# EAGLE design amp-PA-TQP7M9105-with-detect (EAGLE 9.5.1)
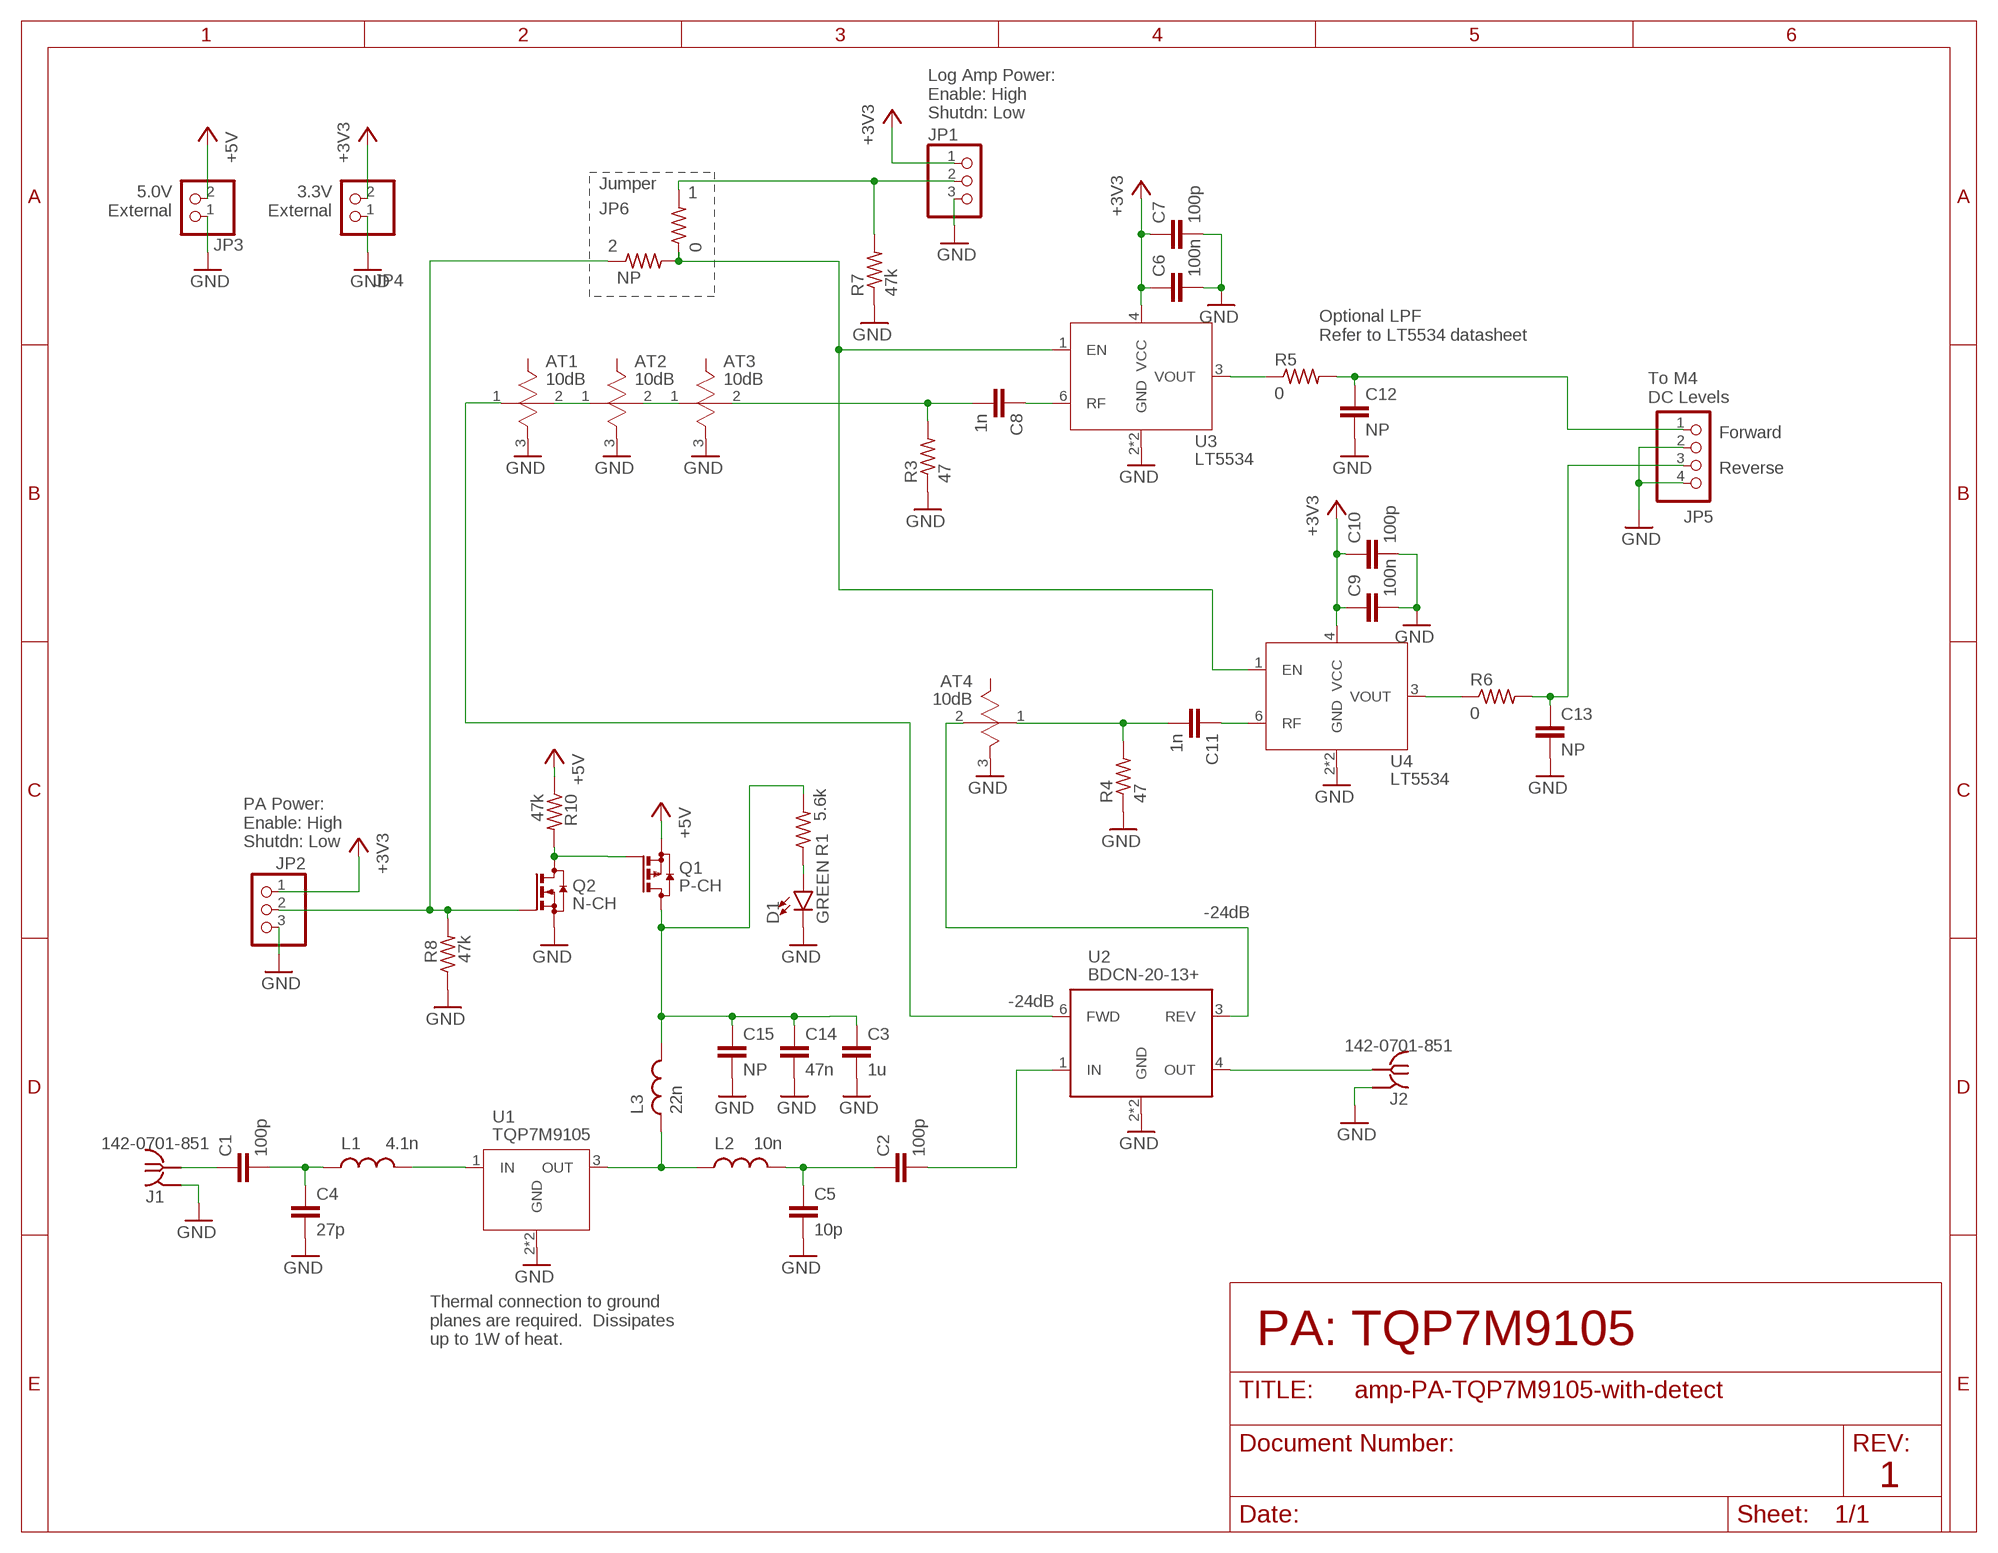
[diagram p0: schematic, sheet 1]

## Parts
AT1  10dB  PAT1220  [0805]
AT2  10dB  PAT0816  [0603]
AT3  10dB  PAT0816  [0603]
AT4  10dB  PAT0816  [0603]
C1  100p  C-EU0402-C-NOSILK  [.0402-C-NOSILK]
C2  100p  C-EU0603-C-NOSILK  [.0603-C-NOSILK]
C3  1u  C-EU0603-B-NOSILK  [.0603-B-NOSILK]
C4  27p  C-EU0402-C-NOSILK  [.0402-C-NOSILK]
C5  10p  C-EU0603-C-NOSILK  [.0603-C-NOSILK]
C6  100n  C-EU0603-B-NOSILK  [.0603-B-NOSILK]
C7  100p  C-EU0603-B-NOSILK  [.0603-B-NOSILK]
C8  1n  C-EU0402-C-NOSILK  [.0402-C-NOSILK]
C9  100n  C-EU0603-B-NOSILK  [.0603-B-NOSILK]
C10  100p  C-EU0603-B-NOSILK  [.0603-B-NOSILK]
C11  1n  C-EU0402-C-NOSILK  [.0402-C-NOSILK]
C12  NP  C-EU0603-B-NOSILK  [.0603-B-NOSILK]
C13  NP  C-EU0603-B-NOSILK  [.0603-B-NOSILK]
C14  47n  C-EU0603-B-NOSILK  [.0603-B-NOSILK]
C15  NP  C-EU0603-B-NOSILK  [.0603-B-NOSILK]
D1  GREEN  LED-GREEN0603  [LED-0603]
J1  142-0701-851  [142-0701-851]
J2  142-0701-851  [142-0701-851]
JP1  PINHD-1X3  [1X03]
JP2  PINHD-1X3  [1X03]
JP3  PINHD-1X2  [1X02]
JP4  PINHD-1X2  [1X02]
JP5  PINHD-1X4  [1X04]
JP6  NP  R-US_0603-B-NOSILK  [.0603-B-NOSILK]
L1  4.1n  L-US0402-C-NOSILK  [.0402-C-NOSILK]
L2  10n  L-US0603-C-NOSILK  [.0603-C-NOSILK@1]
L3  22n  L-US0805-C-NOSILK  [.0805-C-NOSILK]
Q1  P-CH  BSS84  [SOT23]
Q2  N-CH  BSS123  [SOT23]
R1  5.6k  R-US_0603-B-NOSILK  [.0603-B-NOSILK]
R3  47  R-US_0402-C-NOSILK  [.0402-C-NOSILK]
R4  47  R-US_0402-C-NOSILK  [.0402-C-NOSILK]
R5  0  R-US_0603-B-NOSILK  [.0603-B-NOSILK]
R6  0  R-US_0603-B-NOSILK  [.0603-B-NOSILK]
R7  47k  R-US_0402-B-NOSILK  [.0402-B-NOSILK]
R8  47k  R-US_0402-B-NOSILK  [.0402-B-NOSILK]
R9  0  R-US_0603-B-NOSILK  [.0603-B-NOSILK]
R10  47k  R-US_0402-B-NOSILK  [.0402-B-NOSILK]
U1  TQP7M9105  [TQP7M9105]
U2  BDCN-20-13+  [BDCN-20-13+]
U3  LT5534  [SC70]
U4  LT5534  [SC70]

## Nets
+3V3: C6.1 C7.1 C9.1 C10.1 JP1.1 JP2.1 JP4.2 U3.4(VCC) U4.4(VCC)
+5V: JP3.2 Q1.2(S) R10.1
CAPS: C3.1 C14.1 C15.1 L3.2 Q1.3(D) R1.2
FWD: C12.1 JP5.1 R5.2
GND: AT1.3(GND) AT2.3(GND) AT3.3(GND) AT4.3(GND) C3.2 C4.2 C5.2 C6.2 C7.2 C9.2 C10.2 C12.2 C13.2 C14.2 C15.2 D1.C J1.GND1(GND) J1.GND2(GND) J1.GND3(GND) J1.GND4(GND) J2.GND1(GND) J2.GND2(GND) J2.GND3(GND) J2.GND4(GND) JP1.3 JP2.3 JP3.1 JP4.1 JP5.2 JP5.4 Q2.2(S) R3.1 R4.1 R7.1 R8.1 U1.2(GND) U1.PAD(GND) U2.2(GND) U2.5(GND) U3.2(GND) U3.5(GND) U4.2(GND) U4.5(GND)
N$1 [RF2]: C1.1 J1.RF1(RF)
N$2 [RF2]: C2.2 U2.1(IN)
N$3 [RF2]: C1.2 C4.1 L1.1
N$4 [RF2]: L1.2 U1.1(IN)
N$5 [RF2]: L2.1 L3.1 U1.3(OUT)
N$6 [RF2]: C2.1 C5.1 L2.2
N$7 [RF2]: J2.RF1(RF) U2.4(OUT)
N$8 [RF1]: C8.1 U3.6(RF)
N$9 [RF1]: AT3.2 C8.2 R3.2
N$11: JP1.2 R7.2 R9.2
N$12 [RF1]: C11.1 U4.6(RF)
N$13 [RF1]: AT4.1 C11.2 R4.2
N$14: JP6.2 R9.1 U3.1(EN) U4.1(EN)
N$16 [RF1]: AT1.1 U2.6(FWD)
N$17 [RF1]: AT1.2 AT2.1
N$18 [RF1]: AT2.2 AT3.1
N$20: R5.1 U3.3(VOUT)
N$21: R6.1 U4.3(VOUT)
N$22 [RF1]: AT4.2 U2.3(REV)
N$23: Q1.1(G) Q2.3(D) R10.2
N$25: JP2.2 JP6.1 Q2.1(G) R8.2
N$26: D1.A R1.1
REV: C13.1 JP5.3 R6.2

## Notes on the sheet
- Log Amp Power:
  Enable: High
  Shutdn: Low
- Jumper
- 1
- 5.0V
  External
- 3.3V
  External
- 2
- Optional LPF
  Refer to LT5534 datasheet
- To M4
  DC Levels
- Forward
- Reverse
- PA Power:
  Enable: High
  Shutdn: Low
- -24dB
- -24dB
- Thermal connection to ground
  planes are required.  Dissipates
  up to 1W of heat.
- PA: TQP7M9105
- 1

## Library data of the parts
AT1 = AT-Susumu-PAT-attenuator:PAT1220: Chip Attenuator 0805 size (2012 metric) 100 mW Source: Datasheet <https://www.susumu.co.jp/common/pdf/n_catalog_partition16_en.pdf>
AT2-AT4 = AT-Susumu-PAT-attenuator:PAT0816: Chip Attenuator 0603 size (1608 metric) 64 mW Source: Datasheet <https://www.susumu.co.jp/common/pdf/n_catalog_partition16_en.pdf>
C1-C15 = oresat-rcl:C-EU: CAPACITOR, European symbol
D1 = SparkFun-LED:LED-GREEN: Green SMD LED Used in manufacturing of various products at SparkFun Packages: 0603 - SMD 0603 package [Product Link] <http://www.futureelectronics.com/en/technologies/semiconductors/optoelectronics/leds/Pages/9894312-LTST-C190GKT.aspx?CrossPart=HSMG-C190&IM=0> LilyPad 1206 - SMD1206 LilyPad package [Product Link] <http://www.futureelectronics.com/en/Technologies/Product.aspx?ProductID=IN150NGHARVATEKCORPORATION2049943&IM=0> 1206 - SMD1206 package [Product Link] <http://www.futureelectronics.com/en/technologies/semiconductors/optoelectronics/leds/Pages/8315665-LTST-C150KGKT.aspx?IM=0> 1206 Bottom Mount -SMD 1206 Bottom Mount [Product Link] <http://www.digikey.com/product-detail/en/lite-on-inc/LTST-C230KGKT/160-1456-1-ND/386854> SparkFun Products: Pro Mini 328 -5V <https://www.sparkfun.com/products/821> RedBoard <https://www.sparkfun.com/products/12757> MP3 Trigger <https://www.sparkfun.com/products/13720> Makey Makey <https://www.sparkfun.com/products/11076>
J1 J2 = J-Cinch-142-0701-851-SMA-end-launch:142-0701-851: SMA Jack 50Ω - End Launch Source: Datasheet <https://belfuse.com/resources/productinformations/cinchconnectivitysolutions/johnson/pi-ccs-john-142-0701-851.pdf>
JP1 JP2 = pinhead:PINHD-1X3: PIN HEADER
JP3 JP4 = pinhead:PINHD-1X2: PIN HEADER
JP5 = pinhead:PINHD-1X4: PIN HEADER
JP6 R1 R3-R10 = oresat-rcl:R-US_: RESISTOR, American symbol
L1-L3 = oresat-rcl:L-US: INDUCTOR, American symbol
Q1 = transistor-small-signal:BSS84: P-CHANNEL MOS FET
Q2 = transistor-small-signal:BSS123: N-CHANNEL MOS FET
U1 = U-Qorvo-TQP7M9105-PA:TQP7M9105: 1W High Linearity RF Amplifier, 50 - 1500 MHz
U2 = U-MiniCirc-BDCN-20-13+-coupler:BDCN-20-13+: Bi-Directional Coupler Band: 360 to 1000 MHz Coupling: 24 to 17.5 dB Source: Datasheet <https://www.minicircuits.com/pdfs/BDCN-20-13+.pdf>
U3 U4 = U-Linear-LT5534-RF-power-detector:LT5534: RF Power Detector Frequency Range: 50 MHz to 3 GHz Linear Dynamic Range: 60 dB Source: Datasheet <https://www.analog.com/media/en/technical-documentation/data-sheets/5534fc.pdf>

## Net classes
1 RF1: clearance 0.5 mm
2 RF2: clearance 0.8 mm

## Board
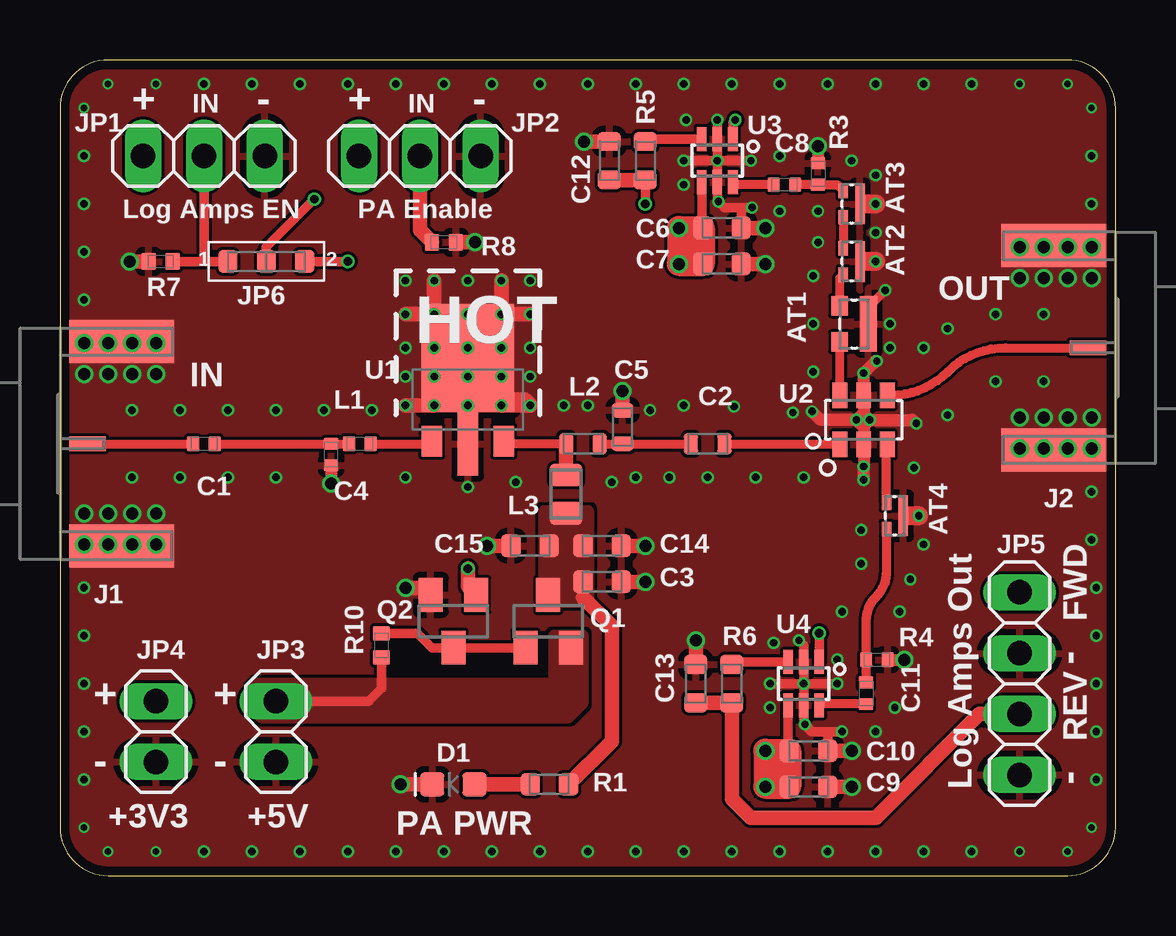
[diagram p1: board, top side]
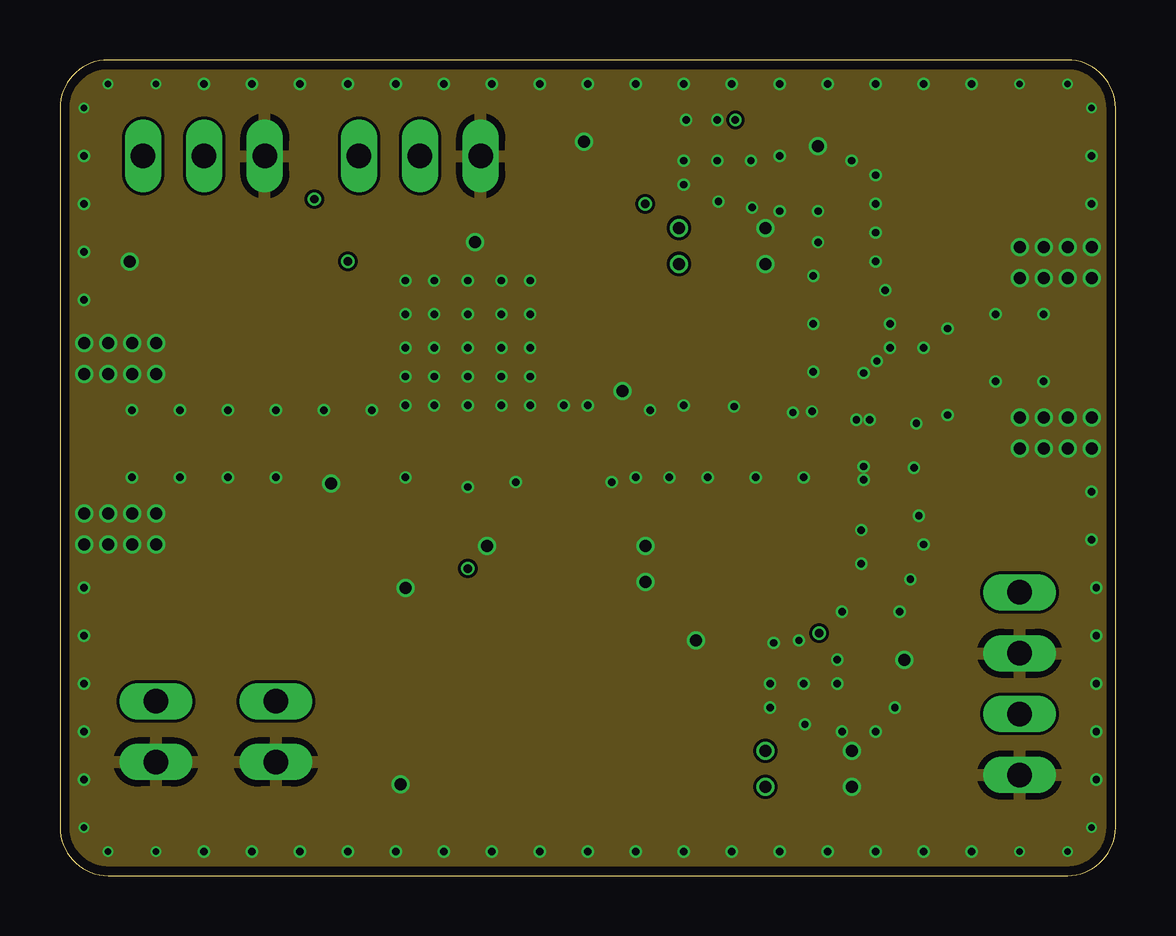
[diagram p2: board, inner layer Route2]
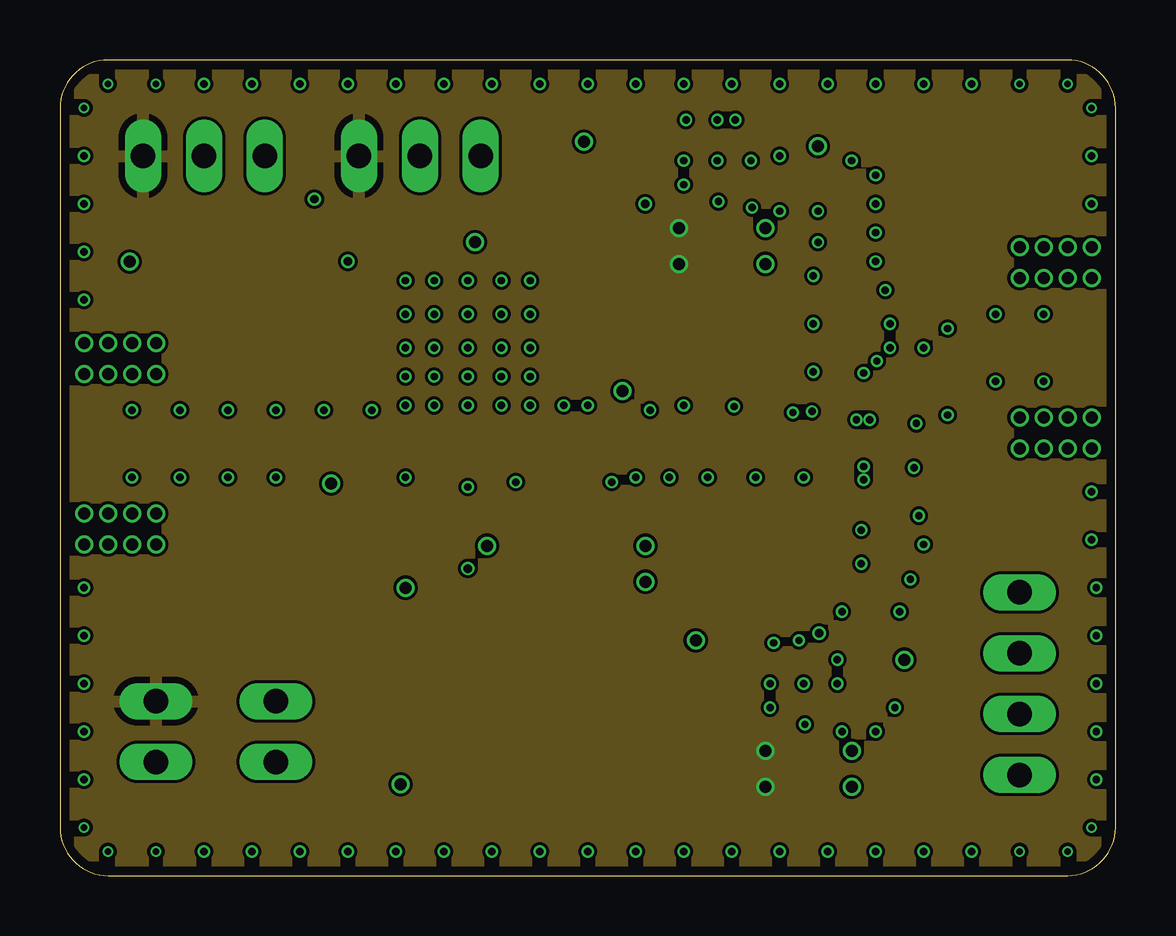
[diagram p3: board, inner layer Route15]
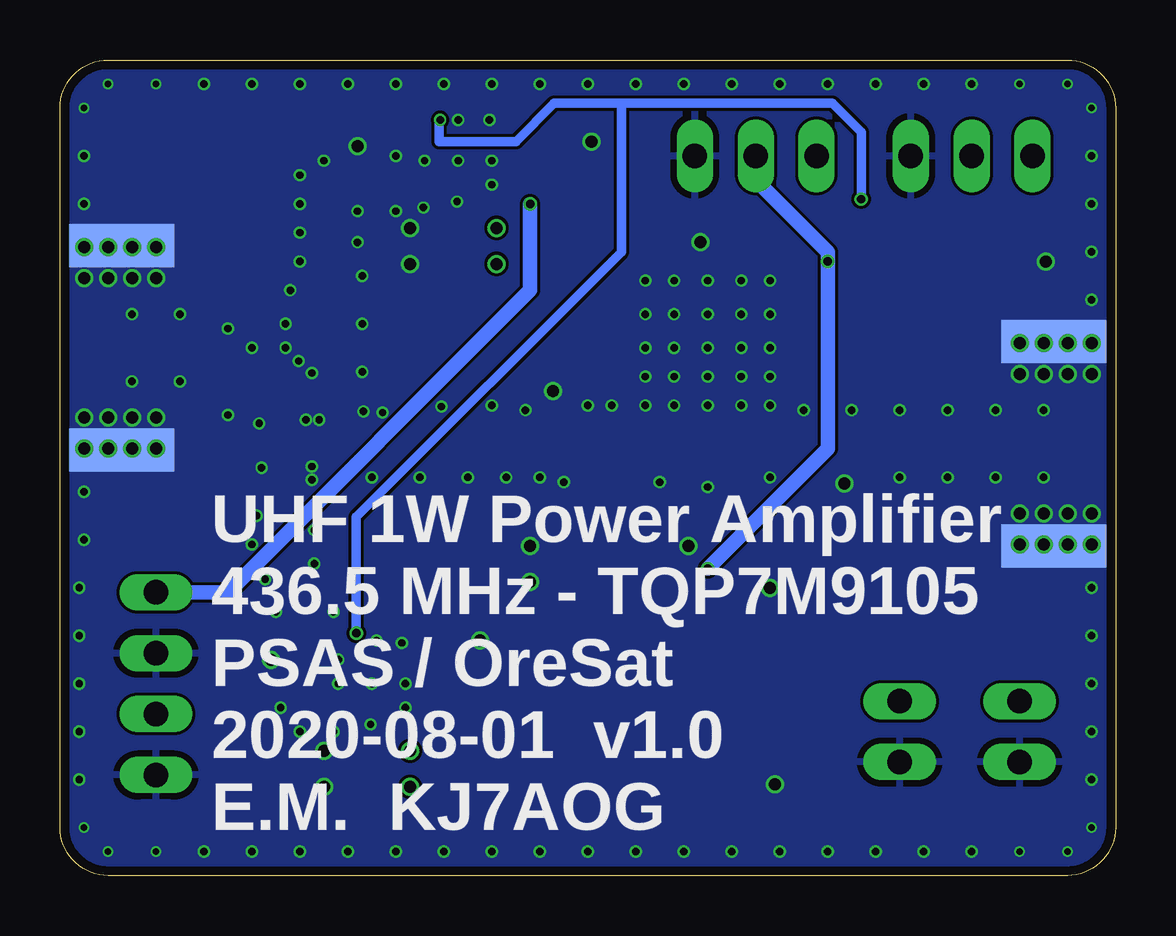
[diagram p4: board, bottom side, seen from below]

Size 44 x 34 mm. Coordinates in mm from the lower left corner, seen from the top.
Outline: 0,32 0,2 arc90 2,0 42,0 arc90 44,2 44,32 arc90 42,34 2,34 arc90 0,32
Copper layers (1*2*15*16): Top 0.035559375mm / dielectric 0.17018125mm / Route2 0.01778125mm / dielectric 47mil / Route15 0.01778125mm / dielectric 0.17018125mm / Bottom 0.035559375mm
Design rules "oshpark-4layer-tented": minimum track width 5mil, minimum drill 10mil, track to track 5mil, track to pad 5mil, pad to pad 5mil, via to via 5mil, smd to smd 5mil, copper to edge 15mil, drill to drill 6mil, minimum pad ring 4mil, minimum via ring 4mil, stop-mask expansion 2.5mil, vias tented up to drill 20mil, thermal gap 10mil

### Footprints (pad centres in the part's own frame; a part is rotated, then mirrored left to right if it is on the bottom)
0805 = smd 0.8 x 0.7: 1 -0.75,0.6; 2 0.75,0.6 | smd 2.3 x 0.7: 3 0,-0.6
0603 = smd 0.6 x 0.4: 1 -0.55,0.35; 2 0.55,0.35 | smd 1.7 x 0.4: 3 0,-0.35
.0402-C-NOSILK = smd 0.5 x 0.6: 1 -0.45,0; 2 0.45,0
.0603-C-NOSILK = smd 0.6 x 0.9: 1 -0.7,0; 2 0.7,0
.0603-B-NOSILK = smd 0.8 x 0.95: 1 -0.8,0; 2 0.8,0
LED-0603 = smd 1 x 1: A -0.877,0; C 0.877,0
142-0701-851 = smd 1.8 x 4.37: GND1 -4.255,-2.566; GND2 4.255,-2.566 | smd 1.8 x 4.37 bottom: GND3 -4.255,-2.566; GND4 4.255,-2.566 | smd 0.6 x 1.53: RF1 0,-1.146
1X03 = drill 1.016 long: 1 -2.54,0; 2 0,0; 3 2.54,0
1X02 = drill 1.016 long: 1 -1.27,0; 2 1.27,0
1X04 = drill 1.016 long: 1 -3.81,0; 2 -1.27,0; 3 1.27,0; 4 3.81,0
.0603-C-NOSILK@1 = smd 0.6 x 0.9: 1 -0.7,0; 2 0.7,0
.0805-C-NOSILK = smd 0.95 x 1.35: 1 -0.8,0; 2 0.8,0
SOT23 = smd 1 x 1.4: 1 -0.95,-1.1; 2 0.95,-1.1; 3 0,1.1
.0402-B-NOSILK = smd 0.6 x 0.7: 1 -0.5,0; 2 0.5,0
TQP7M9105 = smd 0.86 x 1.27: 1 -1.5,0.11; 3 1.5,0.11 | smd 0.86 x 2.65: 2 0,0 | smd 3.86 x 4.5: PAD 0,3.575
BDCN-20-13+ = smd 0.61 x 1.07: 1 -0.99,-1.025; 2 0,-1.025; 3 0.99,-1.025; 4 0.99,1.025; 5 0,1.025; 6 -0.99,1.025
SC70 = smd 0.4 x 1: 1 -0.65,-0.9; 2 0,-0.9; 3 0.65,-0.9; 4 0.65,0.9; 5 0,0.9; 6 -0.65,0.9

### Placement (x,y rotation side)
AT1  33.1,23 90 top
AT2  33,25.6 90 top
AT3  33,28 90 top
AT4  34.8,15 90 top
C1  6,18 0 top
C2  27,18 0 top
C3  22.6,12.25 0 top
C4  11.3,17.55 270 top
C5  23.45,18.7 90 top
C6  27.6,27 0 top
C7  27.6,25.5 0 top
C8  30.2,28.8 0 top
C9  31.2,3.7 0 top
C10  31.2,5.2 0 top
C11  33.6,7.6 90 top
C12  22.9,29.8 90 top
C13  26.5,8 90 top
C14  22.6,13.75 0 top
C15  19.6,13.75 180 top
D1  16.4,3.8 180 top
J1  0,18 90 top
J2  44,22 270 top
JP1  6,30 0 top
JP2  15,30 0 top
JP3  9,6 90 top
JP4  4,6 90 top
JP5  40,8 270 top
JP6  9.4,25.6 180 top
L1  12.5,18 0 top
L2  21.8,18 0 top
L3  21.1,15.9 270 top
Q1  20.35,10.6 0 top
Q2  16.4,10.6 180 top
R1  20.4,3.8 0 top
R3  31.6,29.25 270 top
R4  34.05,9 180 top
R5  24.4,29.8 270 top
R6  28,8 270 top
R7  4.2,25.6 0 top
R8  16,26.4 180 top
R9  7.8,25.6 180 top
R10  13.4,9.6 90 top
U1  17,18 0 top
U2  33.5,19 0 top
U3  27.4,29.8 180 top
U4  31,8 180 top

### Tracks (layer width: path | path; a pad name or v marks a point on that pad's centre or on a via)
+3V3  (via drill 0.5)
  Top 0.4: U3.4 26.75,27.05 C6.1 | U4.4 30.35,5.25 C10.1
  Top 1: C6.1 C7.1 v25.8,25.5 v25.8,27 26.7,27 26.75,27.05 | C10.1 C9.1 v29.4,3.7 v29.4,5.2 C10.1
  pour Route15: 0,34 44,34 44,0 0,0
+5V
  Top 0.4: R10.1 13.4,7.8 12.87,7.27 JP3.2
  pour Top (no thermals): 8,7 8.4,6.6 21.2,6.6 21.8,7.2 21.8,10 20.6,10 20.6,8 8.2,8 8,7.8
CAPS
  Top 0.4: C3.1 21.8,11.6
  Top 0.6: R1.2 23,5.6 23,10.4 21.8,11.6
  pour Top (no thermals): 20.2,15.2 22,15.2 22,11.4 20.2,11.4
FWD  (via drill 0.35)
  Top 0.4: R5.2 v24.4,28
  Top 0.6: C12.1 R5.2
  Bottom 0.4: JP5.1
  Bottom 0.6: v24.4,28 24.4,24.4 37,11.8 JP5.1
GND  (via drill 0.25, 0.3, 0.5)
  Top 0.4: v28.8,29.8 v27.4,29.8 | v27.4,29.8 v26,29.8 | v31,8 v29.6,8 | v31,8 v32.4,8 | v30.8,9.8 31,9.6 U4.2 v31,8 | v27.4,29.8 U3.5 27.4,28.15 v27.45,28.1 27.7,27.85 28.4,27.85 v28.85,27.85 | v31,8 U4.5 31,6.35 v31.05,6.3 31.35,6 32,6 v32.6,6 | v27.4,31.5 U3.2 v27.4,29.8 | v34.4,24.4 33.7,23.7 AT1.3 | C10.2 32,5.9 | C6.2 28.4,27.7
  Top 0.5: C4.2 v11.3,16.35 | v31.6,30.4 R3.1 | R4.1 v35.2,9 | v33.2,19 v33.75,19 | v33.75,19 35.55,19 v35.7,18.85 | v33.2,19 31.7,19 v31.35,19.35 | v33.75,19 33.5,18.75 U2.2 | v33.2,19 33.5,18.7 U2.2 | U2.5 33.5,19.3 v33.2,19 | U2.5 33.5,19.25 v33.75,19 | U2.2 v33.5,17.05 v33.5,16.5 | U2.5 v33.5,20.95 34,21.45 v34.05,21.45
  Top 0.6: v14.2,3.8 D1.C | v33,3.7 C9.2 | v33,5.2 C10.2 | v26.5,9.8 C13.2 | C3.2 v24.4,12.25 | C14.2 v24.4,13.75 | C15.2 v17.8,13.75 | C5.2 v23.45,20.2 | R7.1 v2.9,25.6 | R8.1 v17.3,26.4 | C12.2 v21.85,30.6 | v29.4,27 C6.2 | C7.2 v29.4,25.5 | v14.4,12 15.15,12 Q2.2 | v14.4,19.6 v15.6,19.6 | U1.PAD 18.73,19.84 19.39,19.84 19.61,19.61 | v19.6,19.6 v18.4,19.6 | v14.4,23.4 v15.6,23.4 v15.6,24.8 | v19.6,23.4 v18.4,23.4 v18.4,24.8
  Top 0.8: v34,28 33.55,28 | v34,25.6 33.55,25.6 | v35.8,15 35.35,15
  other vias: 1,15.1 2,15.1 4,15.1 1,13.8 2,13.8 4,13.8 1,20.9 2,20.9 4,20.9 1,22.2 2,22.2 4,22.2 43,26.2 42,26.2 40,26.2 40,24.9 42,24.9 43,24.9 43,17.8 42,17.8 40,17.8 40,19.1 42,19.1 43,19.1 3,16.6 5,16.6 3,19.4 5,19.4 41,20.6 39,20.6 41,23.4 39,23.4 1,2 2,1 4,1 42,1 43,2 40,1 1,32 2,33 4,33 43,32 42,33 40,33 3,20.9 3,22.2 3,15.1 3,13.8 41,19.1 41,17.8 41,24.9 41,26.2 34.6,23 17,19.6 15.6,20.8 17,20.8 18.4,20.8 15.6,22 17,22 18.4,22 17,23.4 19.6,20.8 19.6,22 14.4,20.8 14.4,22 14.4,24.8 17,24.8 19.6,24.8 34.6,22 1,4 1,6 1,8 1,10 1,12 1,30 1,28 1,26 1,24 6,33 8,33 10,33 12,33 14,33 16,33 18,33 20,33 22,33 24,33 26,33 28,33 30,33 32,33 34,33 36,33 38,33 43,30 43,28 43.2,4 43.2,6 43.2,8 43.2,10 43.2,12 43,14 43,16 6,1 8,1 10,1 12,1 14,1 16,1 18,1 20,1 22,1 24,1 26,1 28,1 38,1 36,1 34,1 32,1 30,1 7,16.6 9,16.6 7,19.4 9,19.4 11,19.4 13,19.4 17,16.2 14.4,16.6 19,16.4 37,22.8 36,22 37,19.2 31,16.6 29,16.6 27,16.6 25.4,16.6 23,16.4 24,16.6 21,19.6 22,19.6 24.6,19.4 26,19.6 28.1,19.55 30.55,19.3 34,26.8 33,29.8 34,29.2 30,30 31.6,27.7 30,27.7 31.6,26.4 31.4,21 31.4,23 31.4,25 26,28.8 26.1,31.5 35.6,17 36,13.8 35.45,12.35 35,11 32.4,9 32.6,11 33.4,13 33.4,14.4 34,6 34.8,7 29.6,7 29.75,9.7
  pour Top (rank 2): 0,0 44,0 44,34 0,34
  pour Bottom: 0,0 44,0 44,34 0,34
  pour Top (no thermals): 0,23.5 5.3,23.5 5.3,12.5 0,12.5
  pour Top (no thermals): 38.7,27.5 44,27.5 44,16.5 38.7,16.5
  pour Bottom (no thermals): 38.7,27.5 44,27.5 44,16.5 38.7,16.5
  pour Bottom (no thermals): 0,23.5 5.3,23.5 5.3,12.5 0,12.5
  pour Route2: 0,0 44,0 44,34 0,34
  pour Top (no thermals): 14,25.2 20,25.2 20,19.6 14,19.6
N$1
  Top 0.38: J1.RF1 C1.1
N$2
  Top 0.38: C2.2 32.48,18 U2.1
N$3
  Top 0.38: C1.2 C4.1 L1.1
N$4
  Top 0.38: L1.2 15.39,18 U1.1
N$5
  Top 0.38: L2.1 18.61,18 U1.3
  Top 0.6: L3.1 L2.1
N$6
  Top 0.38: L2.2 C5.1 C2.1
N$7
  Top 0.38: U2.4 34.65,20.02 arc45 37,21 arc-45 39.41,22 J2.RF1
N$8
  Top 0.38: C8.1 28.15,28.8 U3.6
N$9
  Top 0.38: AT3.2 32.4,28.8 R3.2 C8.2
N$11
  Top 0.4: R7.2 6,25.6 | 6,25.6 R9.2 | JP1.2 6,25.6
N$12
  Top 0.38: C11.1 31.7,7.15 U4.6
N$13
  Top 0.38: AT4.1 34.45,12.69 arc-45 34,11.6 arc45 33.6,10.63 R4.2 C11.2
N$14  (via drill 0.3, 0.35)
  Top 0.4: U4.1 v31.65,10.1 | U3.1 28.05,31.4 v28.15,31.5 | v10.6,28.2 8.6,26.2 R9.1
  Bottom 0.4: v31.65,10.1 31.65,14.95 20.6,26 20.6,32.2 | v28.15,31.5 28.2,31.45 28.2,30.6 25,30.6 23.4,32.2 20.6,32.2 | v10.6,28.2 10.6,31 11.8,32.2 20.6,32.2
N$16
  Top 0.38: U2.6 AT1.1
N$17
  Top 0.38: AT1.2 32.5,24.9 AT2.1
N$18
  Top 0.38: AT3.1 AT2.2
N$20
  Top 0.4: U3.3 24.5,30.7 R5.1
N$21
  Top 0.4: R6.1 28.1,8.9 U4.3
N$22
  Top 0.38: AT4.2 34.45,17.93 U2.3
N$23
  Top 0.4: R10.2 14.9,10.1 15.5,9.5 Q2.3 Q1.1
N$25  (via drill 0.35)
  Top 0.4: Q2.1 17,12.05 | JP6.1 v12,25.6
  Top 0.6: JP2.2 15,26.9 R8.2 | 17,12.05 v17,12.8
  Bottom 0.6: v17,12.8 12,17.8 v12,25.6 12,26 15,29 JP2.2
N$26
  Top 0.6: R1.1 D1.A
REV
  Top 0.6: C13.1 R6.2 28,3.2 28.8,2.4 34,2.4 38.33,6.73 JP5.3

### Text on the board
tPlace: + | IN | - | + | IN | - | Log Amps EN | PA Enable | 1 | 2 | OUT | HOT | IN | FWD | - | + | + | REV | - | - | Log Amps Out | - | +3V3 | +5V | PA PWR
bPlace: UHF 1W Power Amplifier / 436.5 MHz - TQP7M9105 / PSAS / OreSat / 2020-08-01 v1.0 / E.M. KJ7AOG